# EAGLE design unit-shield (EAGLE 8.3.2)
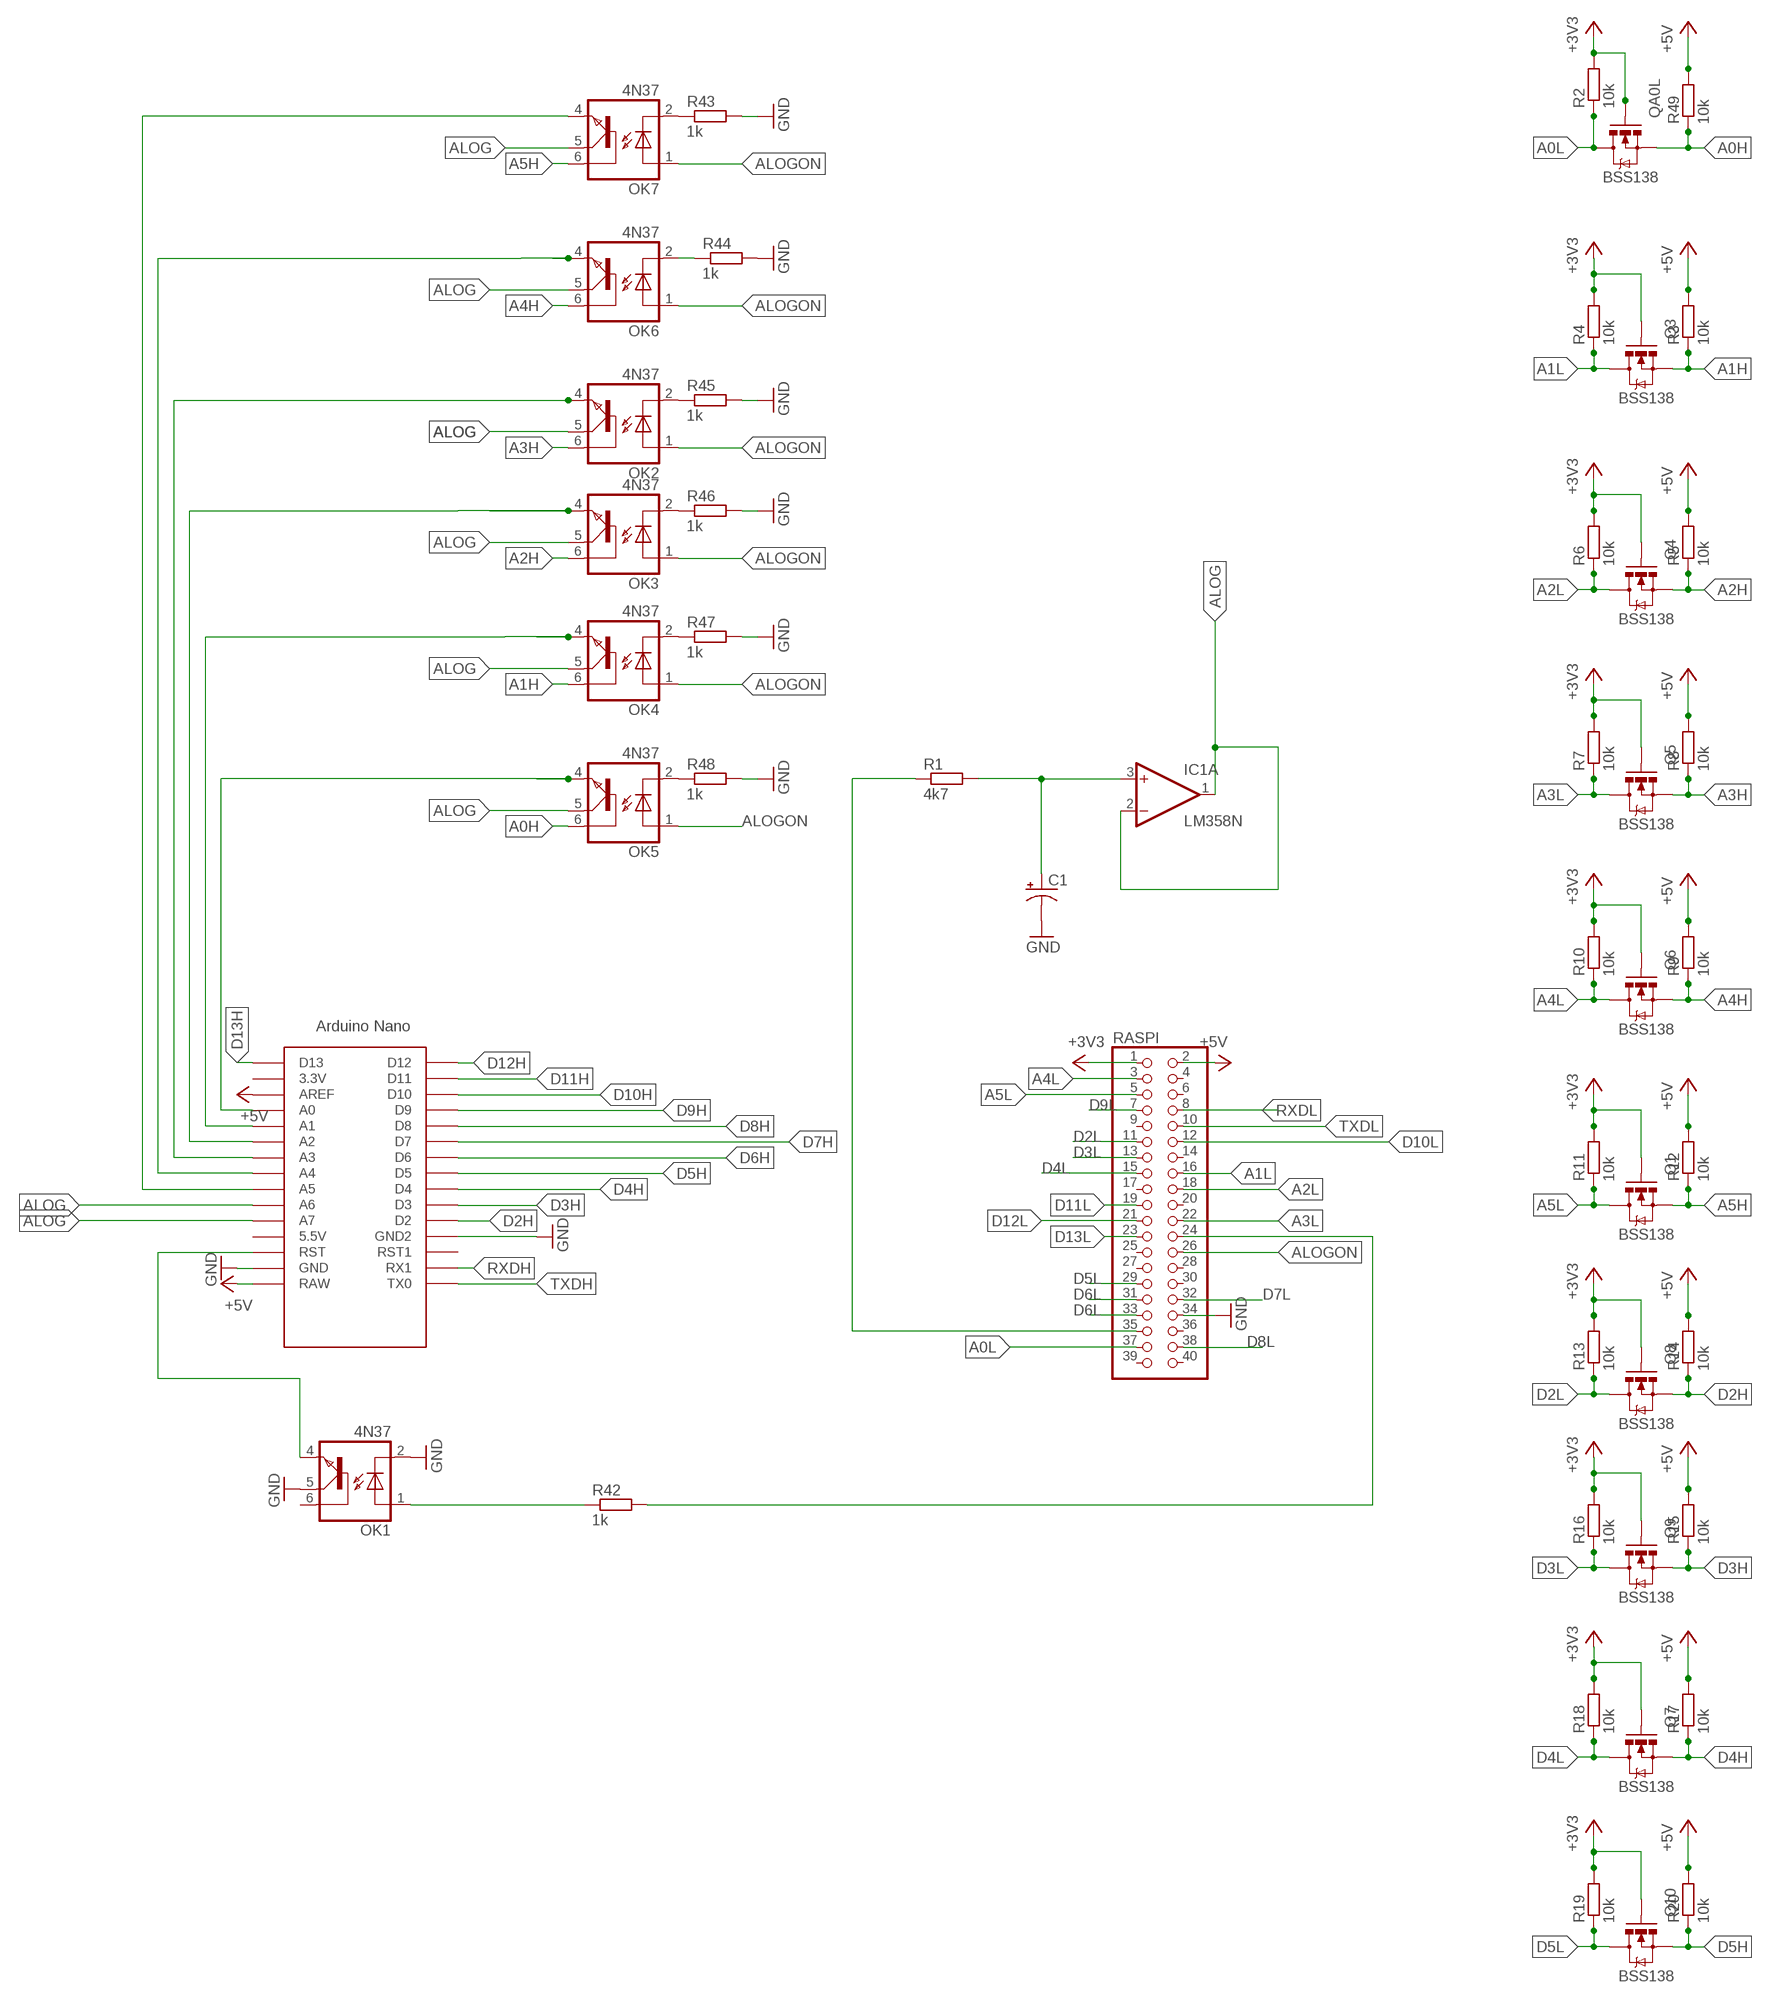
[diagram p0: schematic, sheet 1, part 1 of 2]
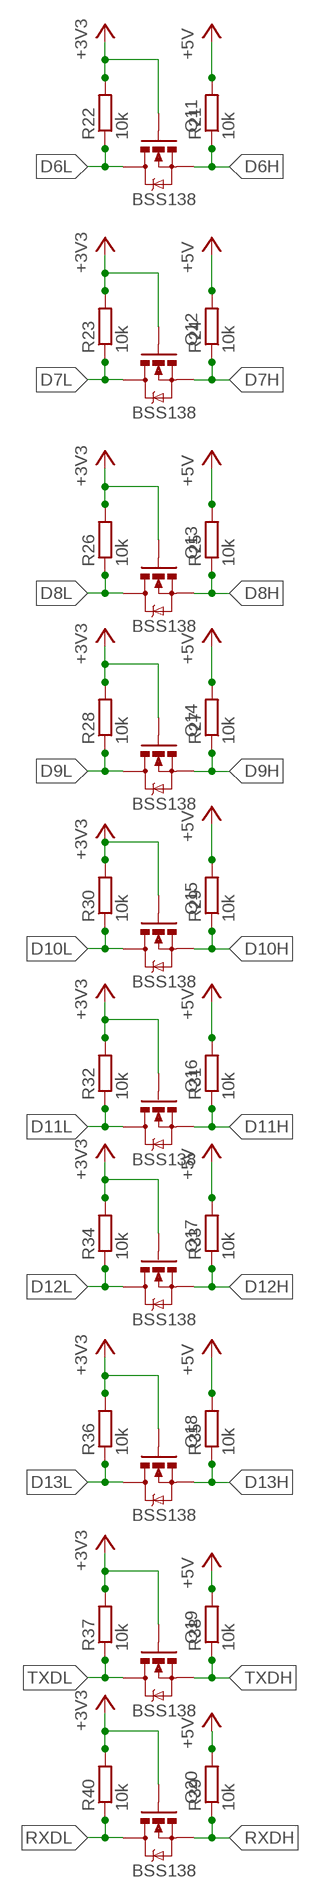
[diagram p1: schematic, sheet 1, part 2 of 2]

## Parts
C1  CPOL-USB  [PANASONIC_B]
IC1  LM358N  [DIL08]
OK1  4N37  [DIL06]
OK2  4N37  [DIL06]
OK3  4N37  [DIL06]
OK4  4N37  [DIL06]
OK5  4N37  [DIL06]
OK6  4N37  [DIL06]
OK7  4N37  [DIL06]
Q1  BSS138  MOSFET-NCHANNELSMD  [SOT23-3]
Q3  BSS138  MOSFET-NCHANNELSMD  [SOT23-3]
Q4  BSS138  MOSFET-NCHANNELSMD  [SOT23-3]
Q5  BSS138  MOSFET-NCHANNELSMD  [SOT23-3]
Q6  BSS138  MOSFET-NCHANNELSMD  [SOT23-3]
Q7  BSS138  MOSFET-NCHANNELSMD  [SOT23-3]
Q8  BSS138  MOSFET-NCHANNELSMD  [SOT23-3]
Q9  BSS138  MOSFET-NCHANNELSMD  [SOT23-3]
Q10  BSS138  MOSFET-NCHANNELSMD  [SOT23-3]
Q11  BSS138  MOSFET-NCHANNELSMD  [SOT23-3]
Q12  BSS138  MOSFET-NCHANNELSMD  [SOT23-3]
Q13  BSS138  MOSFET-NCHANNELSMD  [SOT23-3]
Q14  BSS138  MOSFET-NCHANNELSMD  [SOT23-3]
Q15  BSS138  MOSFET-NCHANNELSMD  [SOT23-3]
Q16  BSS138  MOSFET-NCHANNELSMD  [SOT23-3]
Q17  BSS138  MOSFET-NCHANNELSMD  [SOT23-3]
Q18  BSS138  MOSFET-NCHANNELSMD  [SOT23-3]
Q19  BSS138  MOSFET-NCHANNELSMD  [SOT23-3]
Q20  BSS138  MOSFET-NCHANNELSMD  [SOT23-3]
QA0L  BSS138  MOSFET-NCHANNELSMD  [SOT23-3]
R1  4k7  R-EU_M3216  [M3216]
R2  10k  R-EU_M3216  [M3216]
R3  10k  R-EU_M3216  [M3216]
R4  10k  R-EU_M3216  [M3216]
R5  10k  R-EU_M3216  [M3216]
R6  10k  R-EU_M3216  [M3216]
R7  10k  R-EU_M3216  [M3216]
R8  10k  R-EU_M3216  [M3216]
R9  10k  R-EU_M3216  [M3216]
R10  10k  R-EU_M3216  [M3216]
R11  10k  R-EU_M3216  [M3216]
R12  10k  R-EU_M3216  [M3216]
R13  10k  R-EU_M3216  [M3216]
R14  10k  R-EU_M3216  [M3216]
R15  10k  R-EU_M3216  [M3216]
R16  10k  R-EU_M3216  [M3216]
R17  10k  R-EU_M3216  [M3216]
R18  10k  R-EU_M3216  [M3216]
R19  10k  R-EU_M3216  [M3216]
R20  10k  R-EU_M3216  [M3216]
R21  10k  R-EU_M3216  [M3216]
R22  10k  R-EU_M3216  [M3216]
R23  10k  R-EU_M3216  [M3216]
R24  10k  R-EU_M3216  [M3216]
R25  10k  R-EU_M3216  [M3216]
R26  10k  R-EU_M3216  [M3216]
R27  10k  R-EU_M3216  [M3216]
R28  10k  R-EU_M3216  [M3216]
R29  10k  R-EU_M3216  [M3216]
R30  10k  R-EU_M3216  [M3216]
R31  10k  R-EU_M3216  [M3216]
R32  10k  R-EU_M3216  [M3216]
R33  10k  R-EU_M3216  [M3216]
R34  10k  R-EU_M3216  [M3216]
R35  10k  R-EU_M3216  [M3216]
R36  10k  R-EU_M3216  [M3216]
R37  10k  R-EU_M3216  [M3216]
R38  10k  R-EU_M3216  [M3216]
R39  10k  R-EU_M3216  [M3216]
R40  10k  R-EU_M3216  [M3216]
R42  1k  R-EU_M3216  [M3216]
R43  1k  R-EU_M3216  [M3216]
R44  1k  R-EU_M3216  [M3216]
R45  1k  R-EU_M3216  [M3216]
R46  1k  R-EU_M3216  [M3216]
R47  1k  R-EU_M3216  [M3216]
R48  1k  R-EU_M3216  [M3216]
R49  10k  R-EU_M3216  [M3216]
RASPI  PINHD-2X20  [2X20]
U$1  NANO  [NANO]

## Nets
+3V3: Q1.1(G) Q3.1(G) Q4.1(G) Q5.1(G) Q6.1(G) Q7.1(G) Q8.1(G) Q9.1(G) Q10.1(G) Q11.1(G) Q12.1(G) Q13.1(G) Q14.1(G) Q15.1(G) Q16.1(G) Q17.1(G) Q18.1(G) Q19.1(G) Q20.1(G) QA0L.1(G) R2.2 R4.2 R6.2 R7.2 R10.2 R11.2 R13.2 R16.2 R18.2 R19.2 R22.2 R23.2 R26.2 R28.2 R30.2 R32.2 R34.2 R36.2 R37.2 R40.2 RASPI.1
+5V: R3.2 R5.2 R8.2 R9.2 R12.2 R14.2 R15.2 R17.2 R20.2 R21.2 R24.2 R25.2 R27.2 R29.2 R31.2 R33.2 R35.2 R38.2 R39.2 R49.2 RASPI.2 U$1.AREF U$1.RAW
A0H: OK5.6(BAS) QA0L.2(S) R49.1
A0L: QA0L.3(D) R2.1 RASPI.37
A1H: OK4.6(BAS) Q3.2(S) R3.1
A1L: Q3.3(D) R4.1 RASPI.16
A2H: OK3.6(BAS) Q4.2(S) R5.1
A2L: Q4.3(D) R6.1 RASPI.18
A3H: OK2.6(BAS) Q5.2(S) R8.1
A3L: Q5.3(D) R7.1 RASPI.22
A4H: OK6.6(BAS) Q6.2(S) R9.1
A4L: Q6.3(D) R10.1 RASPI.3
A5H: OK7.6(BAS) Q1.2(S) R12.1
A5L: Q1.3(D) R11.1 RASPI.5
ALOG: IC1.1(A:OUT) IC1.2(A:-IN) OK2.5(COL) OK3.5(COL) OK4.5(COL) OK5.5(COL) OK6.5(COL) OK7.5(COL) U$1.A6 U$1.A7
ALOGON: OK2.1(A) OK3.1(A) OK4.1(A) OK5.1(A) OK6.1(A) OK7.1(A) RASPI.26
D2H: Q8.2(S) R14.1 U$1.D2
D2L: Q8.3(D) R13.1 RASPI.11
D3H: Q9.2(S) R15.1 U$1.D3
D3L: Q9.3(D) R16.1 RASPI.13
D4H: Q7.2(S) R17.1 U$1.D4
D4L: Q7.3(D) R18.1 RASPI.15
D5H: Q10.2(S) R20.1 U$1.D5
D5L: Q10.3(D) R19.1 RASPI.29
D6H: Q11.2(S) R21.1 U$1.D6
D6L: Q11.3(D) R22.1 RASPI.31 RASPI.33
D7H: Q12.2(S) R24.1 U$1.D7
D7L: Q12.3(D) R23.1 RASPI.32
D8H: Q13.2(S) R25.1 U$1.D8
D8L: Q13.3(D) R26.1 RASPI.38
D9H: Q14.2(S) R27.1 U$1.D9
D9L: Q14.3(D) R28.1 RASPI.7
D10H: Q15.2(S) R29.1 U$1.D10
D10L: Q15.3(D) R30.1 RASPI.12
D11H: Q16.2(S) R31.1 U$1.D11
D11L: Q16.3(D) R32.1 RASPI.19
D12H: Q17.2(S) R33.1 U$1.D12
D12L: Q17.3(D) R34.1 RASPI.21
D13H: Q18.2(S) R35.1 U$1.D13
D13L: Q18.3(D) R36.1 RASPI.23
GND: C1.- OK1.2(C) OK1.5(COL) R43.2 R44.2 R45.2 R46.2 R47.2 R48.2 RASPI.34 U$1.GND U$1.GND1(GND2)
N$1: OK1.4(EMI) U$1.RST
N$2: R42.2 RASPI.24
N$3: OK7.2(C) R43.1
N$5: OK2.4(EMI) U$1.A3
N$6: OK3.4(EMI) U$1.A2
N$7: OK4.4(EMI) U$1.A1
N$8: OK5.4(EMI) U$1.A0
N$9: OK3.2(C) R46.1
N$10: OK7.4(EMI) U$1.A5
N$11: R1.1 RASPI.35
N$17: OK6.4(EMI) U$1.A4
N$18: C1.+ IC1.3(A:+IN) R1.2
N$19: OK1.1(A) R42.1
N$23: OK6.2(C) R44.1
N$24: OK2.2(C) R45.1
N$25: OK4.2(C) R47.1
N$26: OK5.2(C) R48.1
RXDH: Q20.2(S) R39.1 U$1.RX1
RXDL: Q20.3(D) R40.1 RASPI.8
TXDH: Q19.2(S) R38.1 U$1.TX0
TXDL: Q19.3(D) R37.1 RASPI.10
Unconnected: IC1.5(B:+IN) IC1.6(B:-IN) IC1.7(B:OUT) OK1.6(BAS) RASPI.4 RASPI.6 RASPI.9 RASPI.14 RASPI.17 RASPI.20 RASPI.25 RASPI.27 RASPI.28 RASPI.30 RASPI.36 RASPI.39 RASPI.40 U$1.3.3V U$1.5V(5.5V) U$1.ICSP1 U$1.ICSP2 U$1.ICSP3 U$1.ICSP4 U$1.ICSP5 U$1.ICSP6 U$1.RST1

## Power pins joined to a net without a drawn wire
V+: IC1.8(P:V+)
V-: IC1.4(P:V-)

## Library data of the parts
C1 = adafruit:CPOL-US: POLARIZED CAPACITOR, American symbol
IC1 = linear:LM358: OP AMP also LM158; LM258; LM2904 Source: http://cache.national.com/ds/LM/LM158.pdf
OK1-OK7 = optocoupler:4N37: OPTO COUPLER Source: http://www.fairchildsemi.com/pf/4N/4N35-M.html; MF: FAIRCHILD SEMICONDUCTOR; MPN: 4N37; OC_FARNELL: 1612456; OC_NEWARK: 72K9948
Q1 Q3-Q20 QA0L = SparkFun:MOSFET-NCHANNEL
R1-R40 R42-R49 = resistor:R-EU_: RESISTOR, European symbol
RASPI = adafruit:PINHD-2X20: PIN HEADER
U$1 = Arduino-clone:NANO: Arduino Nano

## Board
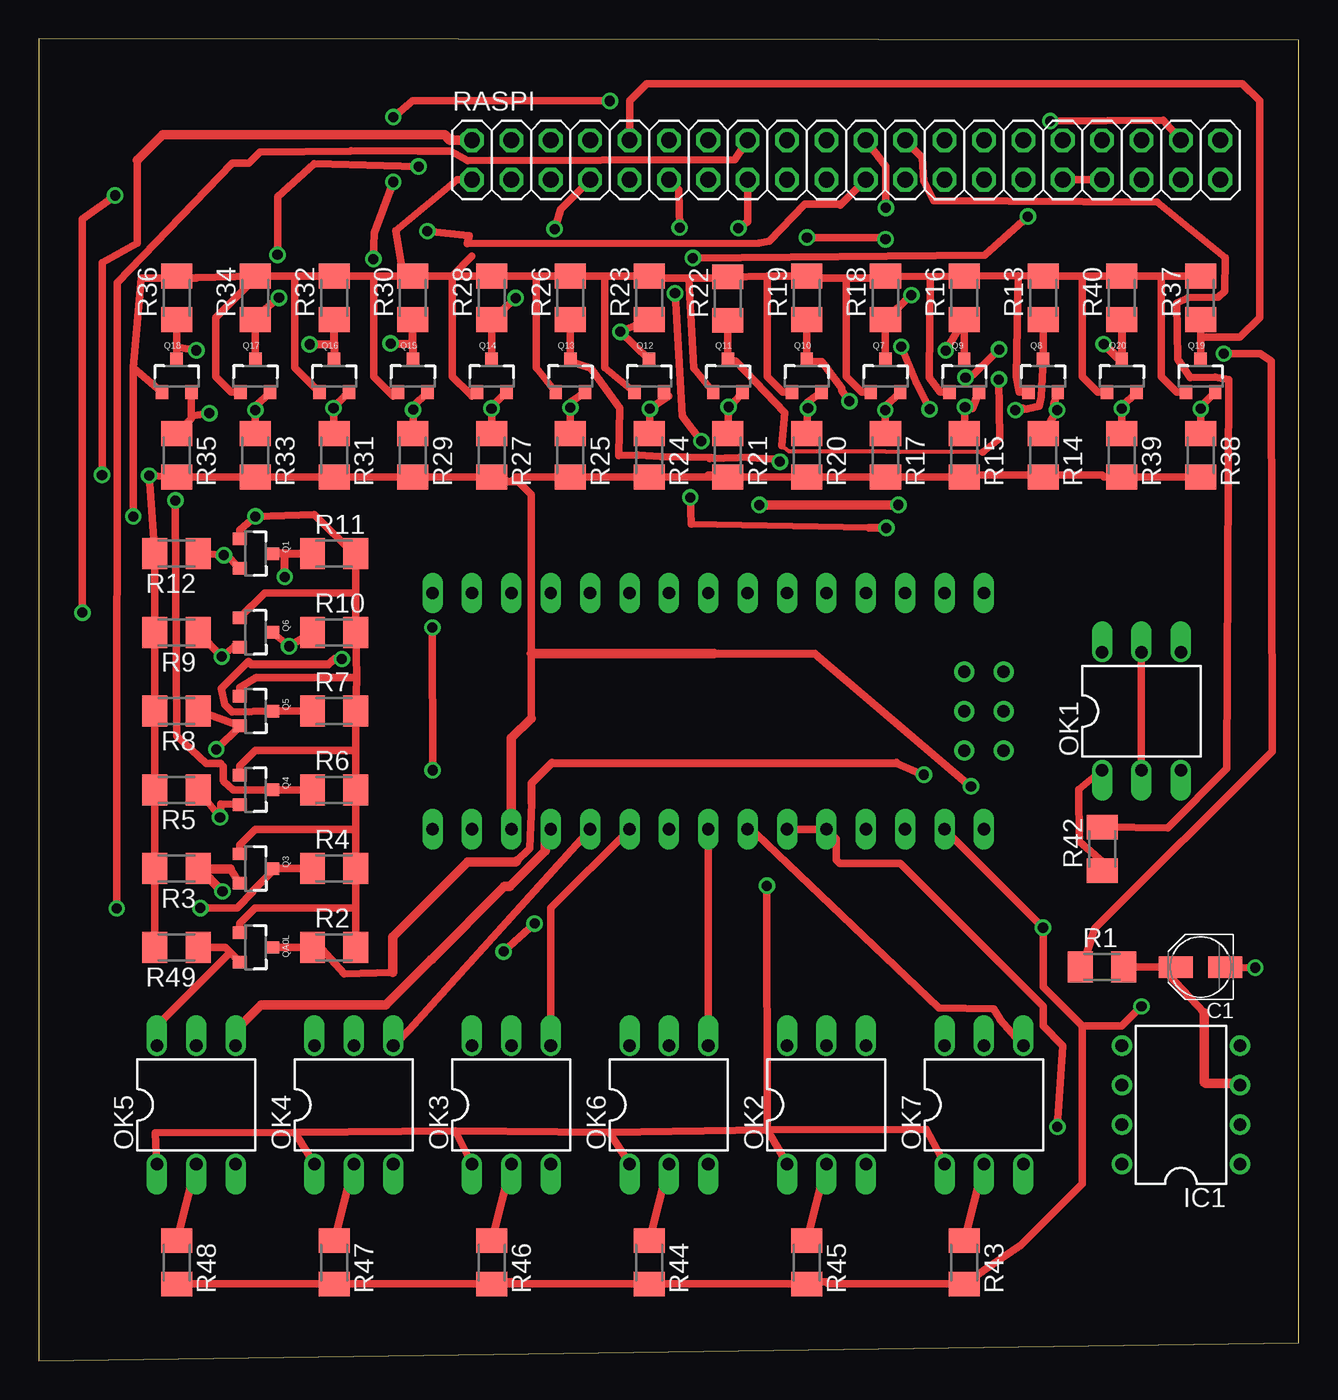
[diagram p2: board, top side]
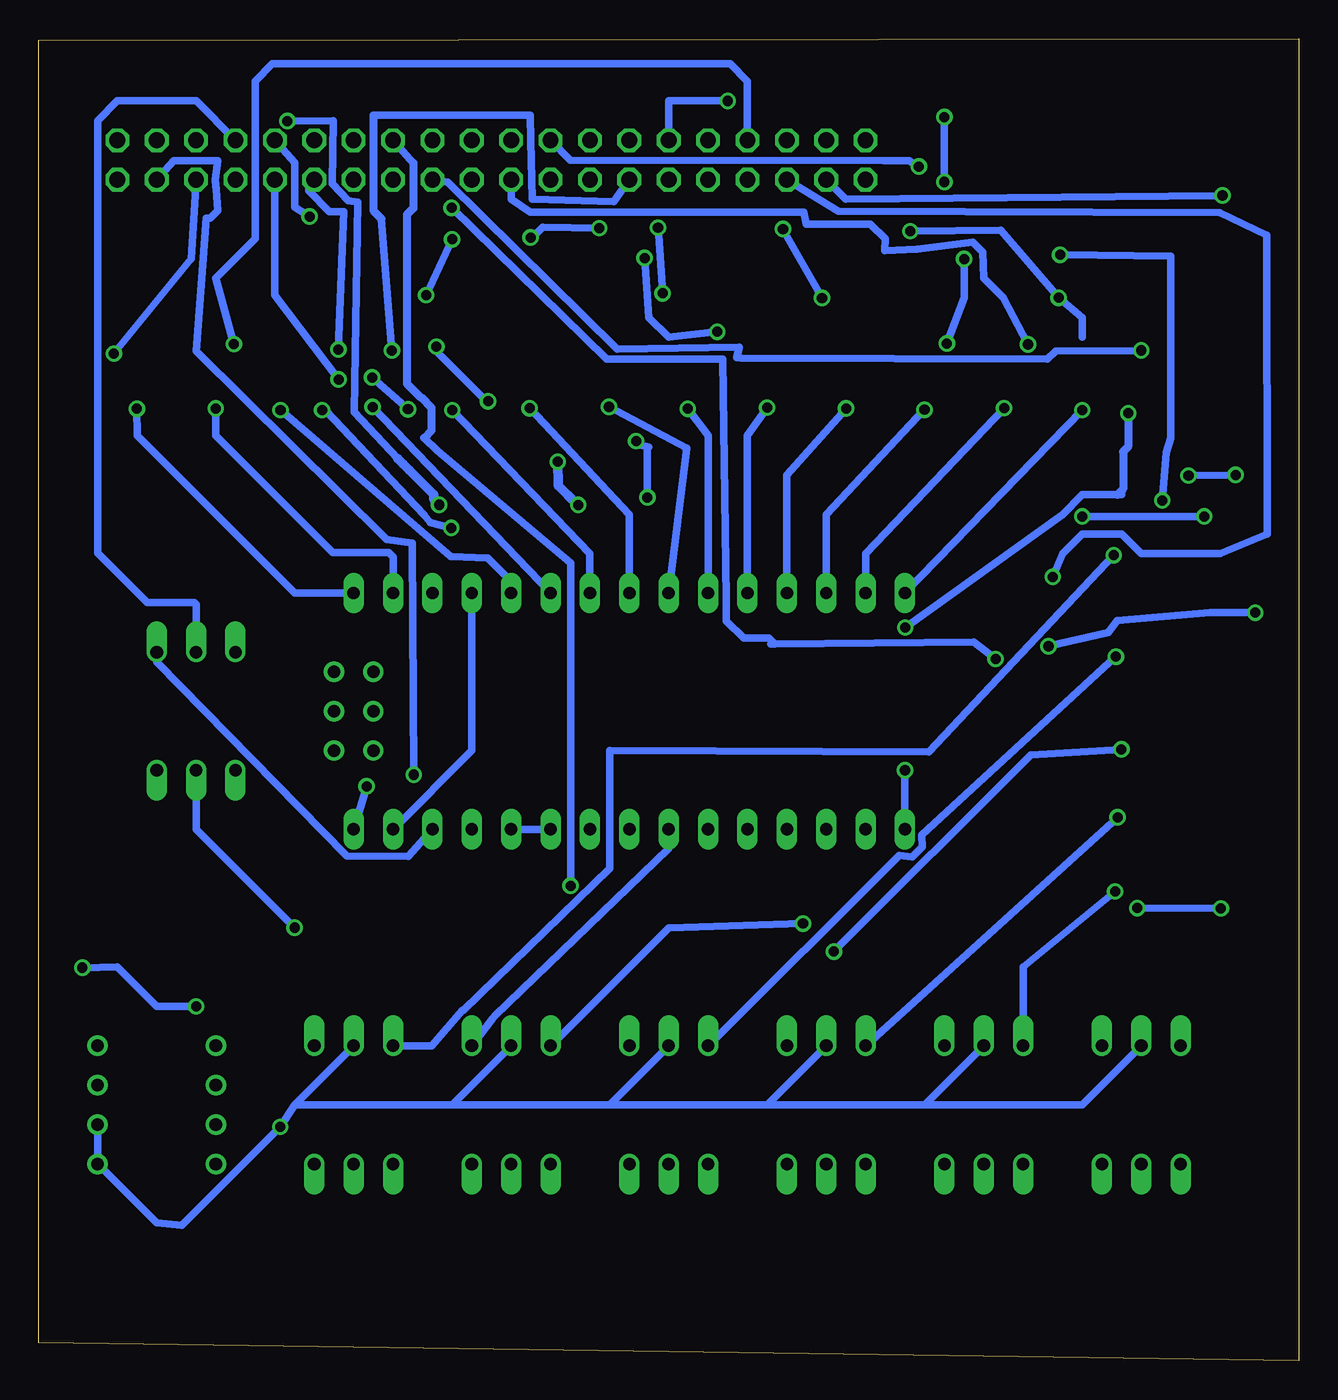
[diagram p3: board, bottom side, seen from below]

Size 81.27 x 85.29 mm. Coordinates in mm from the lower left corner, seen from the top.
Outline: 0,0 81.27,1.16 81.27,85.19 0,85.29 0,0
Copper layers (1*16): Top 0.035mm / dielectric 1.5mm / Bottom 0.035mm
Design rules "default": minimum track width 6mil, minimum drill 0.35mm, track to track 6mil, track to pad 6mil, pad to pad 6mil, via to via 6mil, smd to smd 6mil, copper to edge 40mil, drill to drill 6mil, minimum pad ring 10mil, minimum via ring 8mil, stop-mask expansion 4mil, vias tented up to drill 0mil, thermal gap 10mil

### Footprints (pad centres in the part's own frame; a part is rotated, then mirrored left to right if it is on the bottom)
PANASONIC_B = smd 2.2 x 1.4: + 1.6,0; - -1.6,0
DIL08 = drill 0.813 pad 1.27: 1 -3.81,-3.81; 2 -1.27,-3.81; 3 1.27,-3.81; 4 3.81,-3.81; 5 3.81,3.81; 6 1.27,3.81; 7 -1.27,3.81; 8 -3.81,3.81
DIL06 = drill 0.813 offset: 1 -2.54,-3.81; 2 0,-3.81; 3 2.54,-3.81; 4 2.54,3.81; 5 0,3.81; 6 -2.54,3.81
SOT23-3 = smd 0.8 x 0.9: 1 -0.95,-1; 2 0.95,-1; 3 0,1.1
M3216 = smd 1.6 x 2: 1 -1.4,0; 2 1.4,0
2X20 = drill 1.016 octagon: 1 -24.13,-1.27; 2 -24.13,1.27; 3 -21.59,-1.27; 4 -21.59,1.27; 5 -19.05,-1.27; 6 -19.05,1.27; 7 -16.51,-1.27; 8 -16.51,1.27; 9 -13.97,-1.27; 10 -13.97,1.27; 11 -11.43,-1.27; 12 -11.43,1.27; 13 -8.89,-1.27; 14 -8.89,1.27; 15 -6.35,-1.27; 16 -6.35,1.27; 17 -3.81,-1.27; 18 -3.81,1.27; 19 -1.27,-1.27; 20 -1.27,1.27; 21 1.27,-1.27; 22 1.27,1.27; 23 3.81,-1.27; 24 3.81,1.27; 25 6.35,-1.27; 26 6.35,1.27; 27 8.89,-1.27; 28 8.89,1.27; 29 11.43,-1.27; 30 11.43,1.27; 31 13.97,-1.27; 32 13.97,1.27; 33 16.51,-1.27; 34 16.51,1.27; 35 19.05,-1.27; 36 19.05,1.27; 37 21.59,-1.27; 38 21.59,1.27; 39 24.13,-1.27; 40 24.13,1.27
NANO = drill 0.8 long: 3.3V -10.16,24.13; 5V -10.16,-1.27; A0 -10.16,19.05; A1 -10.16,16.51; A2 -10.16,13.97; A3 -10.16,11.43; A4 -10.16,8.89; A5 -10.16,6.35; A6 -10.16,3.81; A7 -10.16,1.27; AREF -10.16,21.59; D2 5.08,1.27; D3 5.08,3.81; D4 5.08,6.35; D5 5.08,8.89; D6 5.08,11.43; D7 5.08,13.97; D8 5.08,16.51; D9 5.08,19.05; D10 5.08,21.59; D11 5.08,24.13; D12 5.08,26.67; D13 -10.16,26.67; GND -10.16,-6.35; GND1 5.08,-1.27; RAW -10.16,-8.89; RST -10.16,-3.81; RST1 5.08,-3.81; RX1 5.08,-6.35; TX0 5.08,-8.89 | drill 0.8: ICSP1 -5.08,-10.16; ICSP2 -5.08,-7.62; ICSP3 -2.54,-10.16; ICSP4 -2.54,-7.62; ICSP5 0,-10.16; ICSP6 0,-7.62

### Placement (x,y rotation side)
C1  74.93,25.4 180 top
IC1  73.66,16.51 90 top
OK1  71.12,41.91 0 top
OK2  50.8,16.51 0 top
OK3  30.48,16.51 0 top
OK4  20.32,16.51 0 top
OK5  10.16,16.51 0 top
OK6  40.64,16.51 0 top
OK7  60.96,16.51 0 top
Q1  13.97,52.07 270 top
Q3  13.97,31.75 270 top
Q4  13.97,36.83 270 top
Q5  13.97,41.91 270 top
Q6  13.97,46.99 270 top
Q7  54.61,63.5 0 top
Q8  64.77,63.5 0 top
Q9  59.69,63.5 0 top
Q10  49.53,63.5 0 top
Q11  44.45,63.5 0 top
Q12  39.37,63.5 0 top
Q13  34.29,63.5 0 top
Q14  29.21,63.5 0 top
Q15  24.13,63.5 0 top
Q16  19.05,63.5 0 top
Q17  13.97,63.5 0 top
Q18  8.89,63.5 0 top
Q19  74.93,63.5 0 top
Q20  69.85,63.5 0 top
QA0L  13.97,26.67 270 top
R1  68.58,25.4 0 top
R2  19.05,26.67 0 top
R3  8.89,31.75 180 top
R4  19.05,31.75 0 top
R5  8.89,36.83 180 top
R6  19.05,36.83 0 top
R7  19.05,41.91 0 top
R8  8.89,41.91 180 top
R9  8.89,46.99 180 top
R10  19.05,46.99 0 top
R11  19.05,52.07 0 top
R12  8.89,52.07 180 top
R13  64.77,68.58 90 top
R14  64.77,58.42 270 top
R15  59.69,58.42 270 top
R16  59.69,68.58 90 top
R17  54.61,58.42 270 top
R18  54.61,68.58 90 top
R19  49.53,68.58 90 top
R20  49.53,58.42 270 top
R21  44.45,58.42 270 top
R22  44.45,68.53 90 top
R23  39.37,68.58 90 top
R24  39.37,58.42 270 top
R25  34.29,58.42 270 top
R26  34.29,68.58 90 top
R27  29.21,58.42 270 top
R28  29.21,68.58 90 top
R29  24.13,58.42 270 top
R30  24.13,68.58 90 top
R31  19.05,58.42 270 top
R32  19.05,68.58 90 top
R33  13.97,58.42 270 top
R34  13.97,68.58 90 top
R35  8.89,58.42 270 top
R36  8.89,68.58 90 top
R37  74.93,68.58 90 top
R38  74.93,58.42 270 top
R39  69.85,58.42 270 top
R40  69.85,68.58 90 top
R42  68.58,33.02 90 top
R43  59.69,6.35 270 top
R44  39.37,6.35 270 top
R45  49.53,6.35 270 top
R46  29.21,6.35 270 top
R47  19.05,6.35 270 top
R48  8.89,6.35 270 top
R49  8.89,26.67 180 top
RASPI  52.07,77.47 0 top
U$1  52.07,44.45 90 top

### Tracks (layer width: path | path; a pad name or v marks a point on that pad's centre or on a via)
+3V3  (via drill 0.65)
  Top 0.483: 26.67,69.98 R30.2 | 26.67,69.98 R28.2 32.08,69.98 | 32.08,69.98 R26.2 36.51,69.98 | 36.51,69.98 39.24,69.98 39.37,69.85 | 39.37,69.85 41.91,69.85 | 41.91,69.85 44.32,69.85 R22.2 46.99,69.98 | 46.99,69.98 49.4,69.98 49.53,69.85 | 52.07,69.85 49.53,69.85 | 52.07,69.85 54.61,69.85 R18.2 57.51,69.95 | 57.51,69.95 R16.2 63.17,70.01 | 63.17,70.01 R13.2 67.31,69.98 | 67.31,69.98 R40.2 72.39,69.98 | 72.39,69.98 R37.2 | 16.51,69.98 R32.2 21.59,69.98 | 16.51,69.98 R34.2 | 21.59,69.98 R30.2 | R34.2 13.97,69.85 11.43,67.31 11.43,63.5 12.43,62.5 Q17.1 | 16.51,69.98 16.51,64.09 Q16.1 | 21.59,69.98 21.59,63.5 22.7,62.39 | 22.7,62.39 22.86,62.23 | 26.67,69.98 26.67,63.5 27.78,62.39 | 27.78,62.39 27.94,62.23 | 32.08,69.98 32.08,64.09 Q13.1 | 36.51,69.98 36.51,64.09 Q12.1 | 41.91,69.85 42.26,64.04 Q11.1 | Q10.1 47.99,62.5 46.99,63.5 46.99,69.98 | Q7.1 53.07,62.5 52.07,63.5 52.07,69.85 | Q9.1 58.15,62.5 57.44,63.43 57.51,69.95 | Q8.1 63.23,62.5 63.05,63.48 63.17,70.01 | Q20.1 68.31,62.5 67.31,63.5 67.31,69.98 | Q19.1 73.39,62.5 72.39,63.5 72.39,69.98 | Q1.1 12.97,53.61 v13.97,54.48 17.78,54.61 20.32,52.07 R11.2 20.45,49.53 | 20.45,49.53 R10.2 | R10.2 20.45,48.13 | Q6.1 14.56,49.53 20.45,49.53 | 20.5,44.08 R10.2 | 20.5,44.08 R7.2 20.45,39.37 | 20.45,39.37 R6.2 20.45,34.29 | 20.45,34.29 R4.2 20.45,29.21 | 20.32,26.54 R2.2 20.45,29.21 | QA0L.1 12.97,28.21 13.97,29.21 20.45,29.21 | Q3.1 12.97,33.29 13.97,34.29 20.45,34.29 | Q4.1 12.97,38.37 13.97,39.37 20.45,39.37 | Q5.1 12.97,43.45 14.02,44.08 20.5,44.08 | R34.2 10.16,69.88 | 10.16,69.88 10.12,69.88 | 6.1,64.09 6.62,69.85 8.76,69.85 arc90 R36.2 8.89,69.85 10.16,69.85 10.16,69.88 | 6.1,64.09 Q18.1
  Top 0.483: 6.1,64.09 v6.1,54.48 | 27.94,71.25 26.67,69.98 | 22.7,62.39 23.18,62.39 Q15.1 | 39.37,69.85 R23.2 | 27.78,62.39 28.26,62.39 Q14.1 | 49.53,69.85 R19.2 | RASPI.1 26.99,76.2 23.02,72.92 23.5,70.01 R30.2
  Bottom 0.483: v6.1,54.48 v13.97,54.48
+5V  (via drill 0.65)
  Top 0.152: R21.2 43.31,57.02
  Top 0.483: R38.2 R39.2 | R39.2 68.71,57.02 68.58,57.15 64.77,57.15 | 64.77,57.15 59.82,57.15 R15.2 R17.2 R20.2 R21.2 | 43.31,57.02 43.18,57.15 44.32,57.15 R21.2 | R21.2 R24.2 R25.2 30.78,57.02 30.48,56.72 | 30.48,56.72 30.22,56.72 29.92,57.02 R27.2 R29.2 R31.2 R33.2 8.88,57.02 | R49.2 7.49,31.62 7.62,31.75 R3.2 R5.2 R8.2 R9.2 R12.2 v7.12,57.11 8.88,57.02 | 8.88,57.02 R35.2 | 30.48,56.72 30.91,56.72 31.75,55.88 31.75,45.63 31.75,41.45 | 6.35,77.47 6.35,72.12 4.08,70.85 v4.08,57.15 | 64.77,57.15 R14.2 | 69.85,56.99 R39.2
  Top 0.508: 43.57,45.63 50.06,45.63 v60.12,37.06
  Top 0.61: 31.75,45.63 43.57,45.63 | U$1.AREF 30.48,40.18 31.75,41.45 | RASPI.2 26.87,78.74 26.86,78.75 26.76,78.75 26.67,78.8 26.52,78.76 26.18,79.1 7.98,79.1 6.35,77.47
  Bottom 0.483: U$1.RAW v60.12,37.06 | v4.08,57.15 v7.12,57.11
A0H
  Top 0.483: R49.1 12.02,26.67 12.36,26.33 | 12.36,26.33 QA0L.2 | OK5.6 7.62,21.59 12.36,26.33
A0L  (via drill 0.65)
  Top 0.483: QA0L.3 R2.1 18.27,26.55 19.71,24.96 22.83,25.07 | 30.83,32.25 31.68,33.04 31.79,36
  Top 0.508: 31.79,36 31.79,37.27 33.09,38.58 55.31,38.58 v57.09,37.81
  Top 0.61: 22.83,25.07 22.83,27.34 27.68,32.19 30.77,32.19 30.83,32.25
  Bottom 0.483: v57.09,37.81 57.18,52.76 58.81,52.99 71.12,65.12 70.45,73.71 70.22,73.71 69.72,74.21 69.83,75.59 | 69.89,76.21 69.73,77.43 72.56,77.42 RASPI.37 | 69.89,76.21 69.86,75.78 | 69.83,75.59 69.86,75.9 | 69.89,76.21 69.82,75.49 69.83,75.59
A1H  (via drill 0.65)
  Top 0.483: 10.52,31.54 R3.1 | Q3.2 12.34,31.75
  Top 0.61: 12.34,31.75 10.72,31.75 10.52,31.54 | R3.1 10.38,31.75 v11.85,30.28
  Bottom 0.483: OK4.6 17.78,25.4 v11.85,30.28
A1L  (via drill 0.65)
  Top 0.483: 15.24,31.75 Q3.3 | 15.24,31.75 R4.1 | RASPI.16 44.9,77.5 27.68,77.42 26.57,78.05 24.51,78.05 24.46,78.04 20.16,78.07 20.1,78.05 14.26,77.99 13.54,77.27 12.48,77.27 5.06,69.56 v5.03,29.18 | 15.24,31.75 13.81,30.32 13.81,30.24 12.79,29.21 v10.42,29.21
  Bottom 0.483: v5.03,29.18 v10.42,29.21
A2H  (via drill 0.65)
  Top 0.483: R5.1 v11.69,35.06 11.73,35.93 Q4.2
  Bottom 0.483: OK3.6 v11.69,35.06
A2L  (via drill 0.65)
  Top 0.483: R6.1 Q4.3 12.53,36.83 11.95,37.37 11.9,37.48 11.9,38.34 11.72,38.52 10.8,38.52 8.91,40.32 v8.81,55.51 | v15.4,71.36 15.4,75.09 17.77,77.22 v24.5,77.05
  Bottom 0.483: RASPI.18 46.99,77.47 26.78,77.42 25.13,77.42 25.09,77.39 v24.5,77.05 | v8.81,55.51 8.54,58.59 8.26,59.53 8.26,71.28 v15.4,71.36
A3H  (via drill 0.65)
  Top 0.483: R8.1 11.67,41.43 Q5.2 12.97,40.91 v11.44,39.45 | v29.98,26.4 v31.98,28.21
  Bottom 0.483: v11.44,39.45 17.28,39.1 v29.98,26.4 | v31.98,28.21 40.64,27.94 OK2.6
A3L  (via drill 0.65)
  Top 0.483: R7.1 Q5.3 12.47,41.86 12,42.33 11.77,43.37 13.52,45.11 | v54.64,74.39 54.64,77.08 RASPI.22
  Top 0.508: v19.55,45.27 19.12,45.3 18.67,44.92 13.7,44.92 13.52,45.11
  Bottom 0.483: v19.55,45.27 20.95,46.35 33.81,46.23 | 33.81,46.23 34.05,46.23 | v54.64,74.39 44.62,64.62 37.16,64.63 36.91,49.1 36.91,47.72 35.81,46.62 34.2,46.62 33.81,46.23
A4H  (via drill 0.65)
  Top 0.483: R9.1 v11.8,45.42 12.62,46.09 Q6.2
  Bottom 0.483: OK6.6 25.77,32.61 24.92,32.5 24.3,33.16 24.3,33.92 v11.8,45.42
A4L  (via drill 0.65)
  Top 0.483: Q6.3 v16.14,46.1 R10.1 | v2.81,48.26 2.81,73.66 v4.92,75.18
  Bottom 0.483: v16.14,46.1 12.29,46.99 11.7,47.77 5.7,48.27 v2.81,48.26 | v4.92,75.18 29.21,74.93 RASPI.3
A5H  (via drill 0.65)
  Top 0.483: R12.1 v11.94,51.98 12.02,52.07 Q1.2
  Bottom 0.483: OK7.6 55.92,20.32 53.94,22.6 53.89,22.61 44.45,31.75 44.45,39.37 23.88,39.29 v11.94,51.98
A5L  (via drill 0.65)
  Top 0.508: 16.03,52.07 R11.1 | 16.03,52.07 Q1.3 | v15.87,50.57 15.87,51.91 16.03,52.07
  Bottom 0.483: v15.87,50.57 15.24,52.07 13.97,53.34 11.43,53.34 10.16,52.07 5.08,52.07 2.04,53.34 2.07,72.63 5.11,74.08 29.7,74.17 RASPI.5
ALOG  (via drill 0.65)
  Top 0.483: U$1.A6 U$1.A7 51.43,33.66 51.43,32.31 51.66,32.08 55.55,32.08 64.77,22.86 64.77,21.59 66.04,20.32 v65.69,15.09
  Bottom 0.483: IC1.2 IC1.1 73.66,8.89 72.04,8.74 v65.69,15.09 64.77,16.51 | U$1.A6 U$1.A7 | 64.77,16.51 OK7.5 | 64.77,16.51 54.61,16.51 | 54.61,16.51 OK2.5 | 54.61,16.51 44.45,16.51 | 44.45,16.51 OK6.5 | 44.45,16.51 34.29,16.51 | 34.29,16.51 OK3.5 | 34.29,16.51 24.13,16.51 | 24.13,16.51 OK4.5 | 24.13,16.51 13.97,16.51 OK5.5
ALOGON  (via drill 0.65)
  Top 0.483: OK5.1 7.52,14.69 16.51,14.74 | 16.51,14.74 OK4.1 | 16.51,14.74 26.86,14.84 | 26.86,14.84 OK3.1 | 26.86,14.84 36.78,14.74 | 36.78,14.74 OK6.1 | 36.78,14.74 46.99,14.88 | 46.99,14.88 OK2.1 | 46.99,14.88 57.25,14.93 OK7.1 | 46.99,14.88 v46.96,30.64
  Bottom 0.483: RASPI.26 57.11,77.27 | 56.41,59.54 55.56,58.74 46.95,51.45 v46.96,30.64
  Bottom 0.508: 57.11,77.27 57.11,74.36 57.52,73.95 57.52,63.03 56.66,62.16 56.61,62.16 55.94,61.49 55.94,60.01 56.41,59.54
D2H  (via drill 0.65)
  Top 0.483: R14.1 v65.67,61.33 65.46,61.72 Q8.2
  Bottom 0.483: U$1.D2 50.79,50.27 52.32,51.8 54.69,51.88 v65.67,61.33
D2L  (via drill 0.65)
  Top 0.406: 42.08,53.99 53.53,53.75
  Top 0.483: R13.1 Q8.3 64.66,62.19 64.51,61.6 63.67,61.41 | v42.74,59.34 41.49,60.95 v41.04,68.87 | v42.02,55.7 42.08,53.99 | v41.33,73.11 41.27,75.56 RASPI.11 | 63.67,61.41 63.46,61.46 | 63.67,61.41 63.69,61.41 63.35,61.41 63.02,61.37 v62.99,61.33
  Top 0.508: 53.53,53.75 54.64,53.75 v54.67,53.73
  Bottom 0.483: v41.33,73.11 v41.04,68.87 | v62.99,61.33 62.76,61.31 56.42,54.56 56.02,54.07 v54.67,53.73 | v42.02,55.7 42.02,58.84 41.92,58.94 42.45,59.08 v42.74,59.34
D3H  (via drill 0.65)
  Top 0.483: R15.1 v59.74,61.53 60.2,61.42 Q9.2
  Bottom 0.483: U$1.D3 v59.74,61.53
D3L  (via drill 0.65)
  Top 0.483: Q9.3 R16.1 v58.49,65.18
  Bottom 0.483: 59.16,73.68 v58.49,65.18 | 59.69,80.35 49.56,80.35 49.54,78.73 49.45,74.93 44.2,74.8 RASPI.13
  Bottom 0.508: 59.69,80.35 59.69,74.2 59.16,73.68
D4H  (via drill 0.65)
  Top 0.483: R17.1 v54.6,61.33 54.61,61.55 Q7.2
  Bottom 0.483: U$1.D4 45.72,52.07 v54.6,61.33
D4L  (via drill 0.65)
  Top 0.483: Q7.3 R18.1 v56.28,68.75 | RASPI.15 45.72,73.5 v45.12,73.07 | v49.55,72.47 54.57,72.47 54.68,72.36 54.62,72.36 v54.61,72.35
  Bottom 0.483: v54.61,72.35 v56.28,68.75 | v45.12,73.07 48.77,73.15 49.52,72.4 49.52,72.44 v49.55,72.47
D5H  (via drill 0.65)
  Top 0.483: R20.1 v49.61,61.45 49.61,61.86 Q10.2
  Bottom 0.483: U$1.D5 43.18,54.61 v49.61,61.45
D5L  (via drill 0.65)
  Top 0.483: R19.1 Q10.3 49.53,64.45 50.48,64.45 51.8,62.75 51.8,62.59 v52.28,61.91 | v55.62,65.43 56.6,63.1 v57.45,61.39 | v61.94,65.24 59.87,63.25 v59.77,63.44
  Bottom 0.483: v61.94,65.24 61.59,74.14 62.53,74.14 63.86,75.47 63.86,75.84 RASPI.29 | v52.28,61.91 52.54,62.05 55.86,65.37 55.88,65.37 v55.62,65.43 | v59.77,63.44 57.4,61.38 v57.45,61.39
D6H  (via drill 0.65)
  Top 0.483: R21.1 v44.49,61.55 44.57,61.52 Q11.2
  Bottom 0.483: U$1.D6 39.48,58.89 v44.49,61.55
D6L  (via drill 0.65)
  Top 0.305: 47.93,59.04 48.37,58.68 60.88,58.62
  Top 0.483: R22.1 Q11.3 44.45,64.45 44.94,64.51 48.1,61.16 47.93,59.04 | 60.88,58.62 61.97,59.51 v61.93,63.31 | RASPI.31 RASPI.33
  Bottom 0.483: v61.93,63.31 66.04,68.74 RASPI.31
D7H  (via drill 0.65)
  Top 0.483: R24.1 v39.41,61.42 40.64,62.23 40.59,62.23 Q12.2
  Bottom 0.483: U$1.D7 38.1,59.69 v39.41,61.42
D7L  (via drill 0.65)
  Top 0.483: Q12.3 v37.51,66.39 R23.1 | v42.19,71.15 61.01,71.33 v63.79,73.82
  Bottom 0.483: v37.51,66.39 40.64,66.04 41.91,67.31 v42.19,71.15 | RASPI.32 64.77,77.28 64.77,74.43 v63.79,73.82
D8H  (via drill 0.65)
  Top 0.483: R25.1 v34.29,61.49 34.3,61.84 Q13.2
  Bottom 0.483: U$1.D8 35.56,59.69 v34.29,61.49
D8L  (via drill 0.65)
  Top 0.483: R26.1 Q13.3 34.29,64.45 35.6,64.06 37.47,61.47 37.4,58.4 38.65,58.42 40.12,58.33 43.37,58.27 43.28,58.23 43.29,58.22 46.06,58.31 45.75,58.26 47.39,58.19 47.41,58.18 v47.8,58 48,58.19 | v65.23,79.98 72.53,80.02 RASPI.38
  Top 0.508: 55.09,55.22 55.44,55.22 v55.45,55.22
  Top 0.61: v46.47,55.22 55.09,55.22
  Bottom 0.483: 57.77,57.84 58.1,58.19 60.92,61.2 60.7,74.76 61.29,74.84 62.34,75.95 62.28,80 v65.23,79.98
  Bottom 0.508: 55.62,55.4 v55.45,55.22
  Bottom 0.61: v47.8,58 47.76,56.47 47.14,55.86 | 47.14,55.86 | 47.14,55.86 v46.47,55.22 | 57.77,57.84 55.8,55.88 55.8,55.58 55.62,55.4 | 57.38,57.46 57.38,57.48 58.1,58.19
D9H  (via drill 0.65)
  Top 0.483: Q14.2 29.21,61.55 v29.2,61.44 29.21,61.24 R27.1 29.21,59.69
  Bottom 0.483: U$1.D9 33.02,57.15 v29.2,61.44
D9L  (via drill 0.65)
  Top 0.483: Q14.3 R28.1 v30.75,68.57 | v33.27,73.02 33.66,74.3 RASPI.7
  Bottom 0.483: v33.27,73.02 v30.75,68.57
D10H  (via drill 0.65)
  Top 0.483: R29.1 v24.14,61.36 24.13,61.55 Q15.2
  Bottom 0.483: U$1.D10 30.48,54.61 v24.14,61.36
D10L  (via drill 0.65)
  Top 0.483: v36.83,81.28 24.13,81.28 v22.86,80.24 | v22.86,76.05 21.62,72.76 v21.58,71.08
  Top 0.508: 24.13,65.55 R30.1 | 24.13,65.55 Q15.3 | v22.7,65.63 24.05,65.63 24.13,65.55
  Bottom 0.483: RASPI.12 40.64,81.28 v36.83,81.28 | v22.86,80.24 v22.86,76.05 | v21.58,71.08 21.59,68.58 v22.7,65.63
D11H  (via drill 0.65)
  Top 0.483: Q16.2 19.05,61.55 v19.01,61.47 R31.1
  Bottom 0.483: U$1.D11 27.94,52.07 v19.01,61.47
D11L  (via drill 0.65)
  Top 0.508: 19.05,65.73 R32.1 | 19.05,65.73 Q16.3 | v17.47,65.58 18.89,65.58 19.05,65.73
  Bottom 0.483: v17.47,65.58 19.05,68.58 20.32,69.85 20.37,71.52 21.04,72.18 24.62,71.73 26.72,71.62 26.67,72.39 27.65,73.33 31.76,73.33 31.92,74.11 49.56,74.11 50.8,74.93 RASPI.19
D12H  (via drill 0.65)
  Top 0.483: Q17.2 13.97,61.55 v13.97,61.33 R33.1
  Bottom 0.483: U$1.D12 v13.97,61.33
D12L  (via drill 0.65)
  Top 0.483: v25.06,72.88 27.7,72.59 27.75,72.59 27.64,72.09 46.42,72.1 47.1,72.23 49.41,74.61 51.65,74.61 51.7,74.56 RASPI.21 | Q17.3 R34.1 13.97,67.31 v15.49,68.58
  Bottom 0.483: v25.06,72.88 19.24,72.95 v15.49,68.58 13.97,67.31 13.97,66.04
D13H  (via drill 0.65)
  Top 0.483: Q18.2 9.84,60.96 | 9.84,60.96 9.84,60.77 R35.1 | v25.4,38.1 v25.39,47.31 | 9.84,60.96 v11,61.13 | 9.84,60.96
  Bottom 0.483: U$1.D13 v25.4,38.1 | v25.39,47.31 15.24,54.61 13.97,55.88 11.68,55.88 11.43,55.88
  Bottom 0.508: v11,61.13 11,58.97 11.32,58.65 11.32,56.24 11.68,55.88
D13L  (via drill 0.65)
  Top 0.483: R36.1 8.89,65.41 | 8.89,65.41 Q18.3 | 10.24,65.19 8.89,65.41
  Top 0.61: v10.16,65.19 10.24,65.19
  Bottom 0.483: v10.16,65.19 15.68,65.14 16.21,64.62 35.95,64.69 36.24,64.72 36.1,65.39 43.95,65.27 54.9,76.05 RASPI.23
GND  (via drill 0.65)
  Top 0.152: R46.2 30.35,4.95
  Top 0.483: R48.2 R47.2 R46.2 | 30.35,4.95 30.48,5.08 29.34,5.08 R46.2 | R46.2 R44.2 R45.2 49.66,5.08 50.8,5.08 50.93,4.95 R43.2 63.37,7.49 67.31,11.43 67.31,21.59 | 67.31,21.59 64.77,24.13 v64.77,27.94 U$1.GND | 67.31,21.59 69.85,21.59 v71.12,22.86 | OK1.5 OK1.2 | v78.45,25.36 C1.-
  Bottom 0.483: U$1.GND1 53.34,39.37 U$1.GND | v71.12,22.86 73.66,22.86 76.2,25.4 v78.45,25.36 | OK1.2 71.12,34.29 v64.77,27.94 | RASPI.34 71.12,81.28 76.2,81.28 77.47,80.01 77.47,52.11 74.28,48.91 71.24,48.91 71.12,48.8 OK1.5
N$1
  Bottom 0.483: U$1.RST 57.43,32.52 61.39,32.57 73.66,45.09 OK1.4
N$2
  Top 0.483: RASPI.24 56.99,77.63 57.07,76.11 57.72,74.83 72.13,74.76 76.52,71.16 76.48,69.02 76.07,68.63 74.15,68.59 73.38,68.24 73.46,64.62 74.25,63.45 75.88,63.46 76.75,63.3 76.61,38.2 72.8,34.39 68.58,34.45 R42.2
N$3
  Top 0.483: OK7.2 R43.1
N$5
  Bottom 0.483: OK2.4 51.99,22.09 51.87,22.25 40.64,33.06 U$1.A3
N$6
  Top 0.483: OK3.4 33.02,29.21 U$1.A2
N$7
  Top 0.483: OK4.4 23.87,21.32 U$1.A1
N$8
  Top 0.483: U$1.A0 32.98,34.24
  Top 0.61: OK5.4 12.7,21.31 14.36,22.97 22.38,22.97 25.3,25.9 25.33,25.9 30.03,30.6 30.37,30.6 32.67,32.91 32.67,33.95 U$1.A0
N$9
  Top 0.483: OK3.2 R46.1
N$10
  Top 0.483: OK7.4 61.99,22 61.99,22.03 61.58,22.7 58.04,22.78 46.24,34.01 U$1.A5
N$11  (via drill 0.65)
  Top 0.483: R1.1 67.31,25.4 68.12,27.89 79.55,39.32 79.5,64.5 78.78,64.98 v76.42,64.98
  Bottom 0.483: v76.42,64.98 71.44,71.12 RASPI.35
N$17
  Top 0.483: U$1.A4 OK6.4
N$18
  Top 0.483: 72.39,25.4 C1.+ | 72.39,25.4 R1.2 | 72.39,25.4 75.18,22.45
  Top 0.61: 75.18,22.45 75.18,17.96 75.27,17.88 77.37,17.88 IC1.3
N$19
  Top 0.483: R42.1 68.58,32.23 67.1,33.5 67.06,36.85 OK1.1
N$23
  Top 0.483: OK6.2 R44.1
N$24
  Top 0.483: OK2.2 R45.1
N$25
  Top 0.483: OK4.2 R47.1
N$26
  Top 0.483: R48.1 OK5.2
RXDH  (via drill 0.65)
  Top 0.483: R39.1 v69.85,61.44 69.85,61.55 Q20.2
  Bottom 0.483: v69.85,61.44 69.85,59.69 62.3,52.14 58.71,52.14 58.42,51.85 U$1.RX1
RXDL  (via drill 0.65)
  Top 0.483: v68.68,65.59 Q20.3
  Top 0.508: R40.1 69.85,64.83 69.72,64.71 69.56,64.71 v68.68,65.59
  Bottom 0.483: v68.68,65.59 69.85,69.85 67.31,72.39 67.31,82.55 66.19,83.67 36.68,83.67 35.56,82.55 RASPI.8
TXDH  (via drill 0.65)
  Top 0.483: R38.1 v74.94,61.42 74.93,61.55 Q19.2
  Bottom 0.483: U$1.TX0 64.77,49.53 74.93,59.69 v74.94,61.42
TXDL
  Top 0.483: R37.1 74.93,66.04 | 74.93,66.04 Q19.3 | 74.93,66.04 77.47,66.04 78.74,67.31 78.74,81.28 77.62,82.4 39.22,82.4 38.1,81.28 RASPI.10